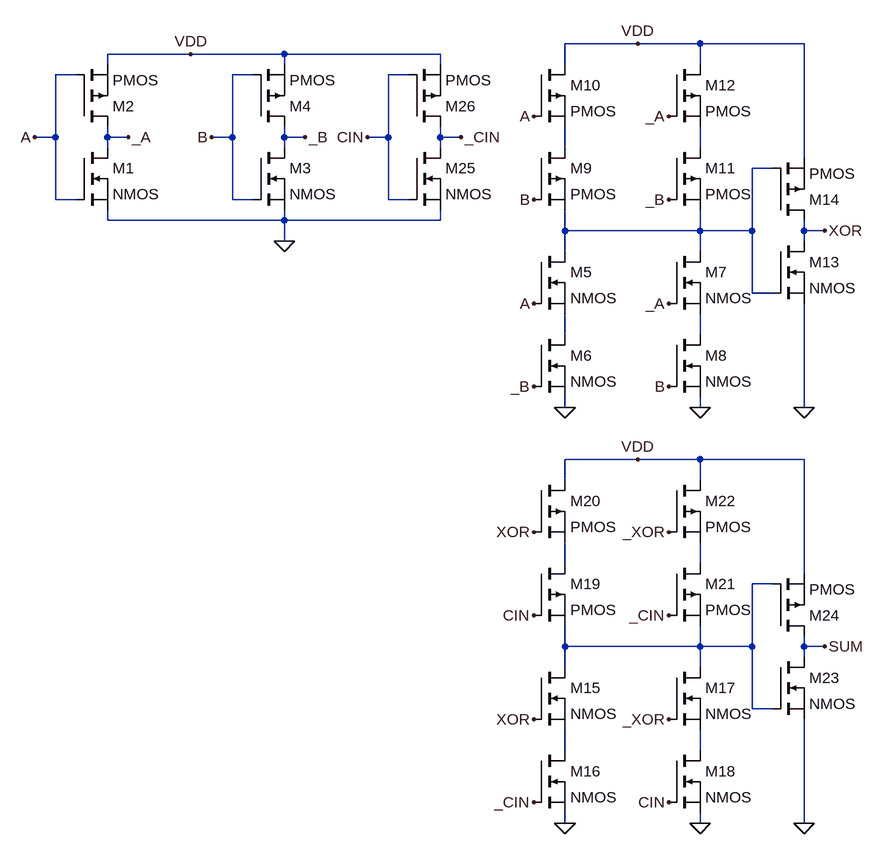
[diagram p0: schematic FA version3.asc]
FA version3.asc, the LTspice schematic file:
Version 4
SHEET 1 880 1148
WIRE 256 -96 144 -96
WIRE 352 -96 256 -96
WIRE 512 -96 352 -96
WIRE -432 -80 -560 -80
WIRE -288 -80 -432 -80
WIRE -48 -80 -288 -80
WIRE -560 -64 -560 -80
WIRE -288 -64 -288 -80
WIRE -48 -64 -48 -80
WIRE 144 -64 144 -96
WIRE 352 -64 352 -96
WIRE -608 -48 -640 -48
WIRE -336 -48 -368 -48
WIRE -96 -48 -128 -48
WIRE -640 48 -640 -48
WIRE -640 48 -672 48
WIRE -560 48 -560 32
WIRE -528 48 -560 48
WIRE -368 48 -368 -48
WIRE -368 48 -400 48
WIRE -288 48 -288 32
WIRE -256 48 -288 48
WIRE -128 48 -128 -48
WIRE -128 48 -160 48
WIRE -48 48 -48 32
WIRE -16 48 -48 48
WIRE -560 64 -560 48
WIRE -288 64 -288 48
WIRE -48 64 -48 48
WIRE 144 64 144 32
WIRE 352 64 352 32
WIRE 512 80 512 -96
WIRE 464 96 432 96
WIRE -640 144 -640 48
WIRE -608 144 -640 144
WIRE -368 144 -368 48
WIRE -336 144 -368 144
WIRE -128 144 -128 48
WIRE -96 144 -128 144
WIRE -560 176 -560 160
WIRE -288 176 -288 160
WIRE -288 176 -560 176
WIRE -48 176 -48 160
WIRE -48 176 -288 176
WIRE 144 192 144 160
WIRE 352 192 352 160
WIRE 352 192 144 192
WIRE 432 192 432 96
WIRE 432 192 352 192
WIRE 512 192 512 176
WIRE 544 192 512 192
WIRE -288 208 -288 176
WIRE 512 208 512 192
WIRE 144 224 144 192
WIRE 352 224 352 192
WIRE 432 288 432 192
WIRE 464 288 432 288
WIRE 144 352 144 320
WIRE 352 352 352 320
WIRE 144 464 144 448
WIRE 352 464 352 448
WIRE 512 464 512 304
WIRE 256 544 144 544
WIRE 352 544 256 544
WIRE 512 544 352 544
WIRE 144 576 144 544
WIRE 352 576 352 544
WIRE 144 704 144 672
WIRE 352 704 352 672
WIRE 512 720 512 544
WIRE 464 736 432 736
WIRE 144 832 144 800
WIRE 352 832 352 800
WIRE 352 832 144 832
WIRE 432 832 432 736
WIRE 432 832 352 832
WIRE 512 832 512 816
WIRE 544 832 512 832
WIRE 512 848 512 832
WIRE 144 864 144 832
WIRE 352 864 352 832
WIRE 432 928 432 832
WIRE 464 928 432 928
WIRE 144 992 144 960
WIRE 352 992 352 960
WIRE 144 1104 144 1088
WIRE 352 1104 352 1088
WIRE 512 1104 512 944
FLAG -672 48 A
FLAG -528 48 _A
FLAG -400 48 B
FLAG -256 48 _B
FLAG -288 208 0
FLAG -432 -80 VDD
FLAG 352 464 0
FLAG 144 464 0
FLAG 256 -96 VDD
FLAG 512 464 0
FLAG 96 304 A
FLAG 96 16 A
FLAG 96 144 B
FLAG 304 432 B
FLAG 304 16 _A
FLAG 304 304 _A
FLAG 304 144 _B
FLAG 96 432 _B
FLAG 544 192 XOR
FLAG 352 1104 0
FLAG 144 1104 0
FLAG 256 544 VDD
FLAG 512 1104 0
FLAG -16 48 _CIN
FLAG -160 48 CIN
FLAG 96 944 XOR
FLAG 96 656 XOR
FLAG 96 784 CIN
FLAG 304 1072 CIN
FLAG 304 656 _XOR
FLAG 304 944 _XOR
FLAG 304 784 _CIN
FLAG 96 1072 _CIN
FLAG 544 832 SUM
SYMBOL nmos -608 64 R0
SYMATTR InstName M1
SYMBOL pmos -608 32 M180
SYMATTR InstName M2
SYMBOL nmos -336 64 R0
SYMATTR InstName M3
SYMBOL pmos -336 32 M180
SYMATTR InstName M4
SYMBOL nmos 96 224 R0
SYMATTR InstName M5
SYMBOL nmos 96 352 R0
SYMATTR InstName M6
SYMBOL nmos 304 224 R0
SYMATTR InstName M7
SYMBOL nmos 304 352 R0
SYMATTR InstName M8
SYMBOL pmos 96 64 R0
SYMATTR InstName M9
SYMBOL pmos 96 -64 R0
SYMATTR InstName M10
SYMBOL pmos 304 64 R0
SYMATTR InstName M11
SYMBOL pmos 304 -64 R0
SYMATTR InstName M12
SYMBOL nmos 464 208 R0
SYMATTR InstName M13
SYMBOL pmos 464 176 M180
SYMATTR InstName M14
SYMBOL nmos 96 864 R0
SYMATTR InstName M15
SYMBOL nmos 96 992 R0
SYMATTR InstName M16
SYMBOL nmos 304 864 R0
SYMATTR InstName M17
SYMBOL nmos 304 992 R0
SYMATTR InstName M18
SYMBOL pmos 96 704 R0
SYMATTR InstName M19
SYMBOL pmos 96 576 R0
SYMATTR InstName M20
SYMBOL pmos 304 704 R0
SYMATTR InstName M21
SYMBOL pmos 304 576 R0
SYMATTR InstName M22
SYMBOL nmos 464 848 R0
SYMATTR InstName M23
SYMBOL pmos 464 816 M180
SYMATTR InstName M24
SYMBOL nmos -96 64 R0
SYMATTR InstName M25
SYMBOL pmos -96 32 M180
SYMATTR InstName M26

The netlist it stands for:
* FA version3.asc
M1 _A A 0 0 NMOS
M2 _A A VDD VDD PMOS
M3 _B B 0 0 NMOS
M4 _B B VDD VDD PMOS
M5 N003 A N004 N004 NMOS
M6 N004 _B 0 0 NMOS
M7 N003 _A N005 N005 NMOS
M8 N005 B 0 0 NMOS
M9 N001 B N003 N003 PMOS
M10 VDD A N001 N001 PMOS
M11 N002 _B N003 N003 PMOS
M12 VDD _A N002 N002 PMOS
M13 XOR N003 0 0 NMOS
M14 XOR N003 VDD VDD PMOS
M15 N008 XOR N009 N009 NMOS
M16 N009 _CIN 0 0 NMOS
M17 N008 _XOR N010 N010 NMOS
M18 N010 CIN 0 0 NMOS
M19 N006 CIN N008 N008 PMOS
M20 VDD XOR N006 N006 PMOS
M21 N007 _CIN N008 N008 PMOS
M22 VDD _XOR N007 N007 PMOS
M23 SUM N008 0 0 NMOS
M24 SUM N008 VDD VDD PMOS
M25 _CIN CIN 0 0 NMOS
M26 _CIN CIN VDD VDD PMOS
.model NMOS NMOS
.model PMOS PMOS
.lib standard.mos
.backanno
.end